# EAGLE design board (EAGLE 6.4)
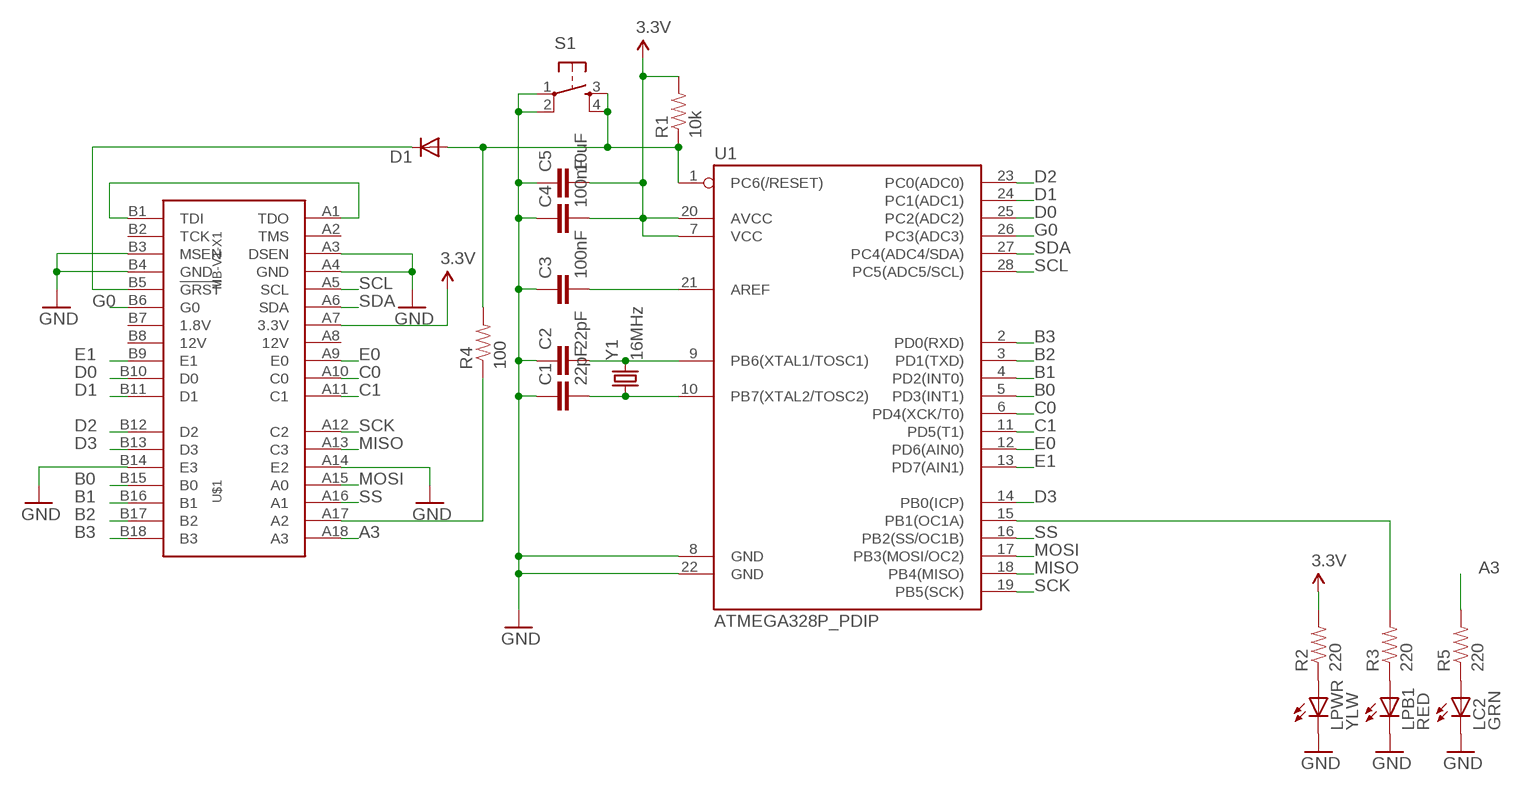
[diagram p0: schematic, sheet 1]

## Parts
C1  22pF  CAP0402-CAP  [0402-CAP]
C2  22pF  CAP0402-CAP  [0402-CAP]
C3  100nF  CAP0402-CAP  [0402-CAP]
C4  100nF  CAP0402-CAP  [0402-CAP]
C5  10uF  CAP0805  [0805]
D1  DIODE1N4148  [DIODE-1N4148]
LC2  GRN  LED-RED0603  [LED-0603]
LPB1  RED  LED-RED0603  [LED-0603]
LPWR  YLW  LED-RED0603  [LED-0603]
R1  10k  RESISTOR0603  [0603-RES]
R2  220  RESISTOR0603  [0603-RES]
R3  220  RESISTOR0603  [0603-RES]
R4  100  RESISTOR0603  [0603-RES]
R5  220  RESISTOR0603  [0603-RES]
S1  TAC_SWITCHPTH  [TACTILE-PTH]
U1  ATMEGA328P_PDIP  [DIL28-3]
U$1  MB-V1-X1  [PCIE-X1-EDGE]
Y1  16MHz  CRYSTALHC49US  [HC49US]

## Nets
3.3V: C4.2 C5.2 R1.2 R2.2 U1.7(VCC) U1.20(AVCC) U$1.A7(3.3V)
A3: R5.2 U$1.A18(A3)
B0: U1.5(PD3(INT1)) U$1.B15(B0)
B1: U1.4(PD2(INT0)) U$1.B16(B1)
B2: U1.3(PD1(TXD)) U$1.B17(B2)
B3: U1.2(PD0(RXD)) U$1.B18(B3)
C0: U1.6(PD4(XCK/T0)) U$1.A10(C0)
C1: U1.11(PD5(T1)) U$1.A11(C1)
D0: U1.25(PC2(ADC2)) U$1.B10(D0)
D1: U1.24(PC1(ADC1)) U$1.B11(D1)
D2: U1.23(PC0(ADC0)) U$1.B12(D2)
D3: U1.14(PB0(ICP)) U$1.B13(D3)
E0: U1.12(PD6(AIN0)) U$1.A9(E0)
E1: U1.13(PD7(AIN1)) U$1.B9(E1)
G0: U1.26(PC3(ADC3)) U$1.B6(G0)
GND: C1.1 C2.1 C3.1 C4.1 C5.1 LC2.C LPB1.C LPWR.C S1.1 S1.2 U1.8(GND) U1.22(GND) U$1.A3(DSEN) U$1.A4(GND) U$1.A14(E2) U$1.B3(MSEN) U$1.B4(GND) U$1.B14(E3)
MISO: U1.18(PB4(MISO)) U$1.A13(C3)
MOSI: U1.17(PB3(MOSI/OC2)) U$1.A15(A0)
N$1: D1.C U$1.B5(!GRST)
N$2: LPB1.A R3.1
N$3: C2.2 U1.9(PB6(XTAL1/TOSC1)) Y1.2
N$4: C1.2 U1.10(PB7(XTAL2/TOSC2)) Y1.1
N$5: C3.2 U1.21(AREF)
N$6: U$1.A1(TDO) U$1.B1(TDI)
N$7: LC2.A R5.1
N$8: R3.2 U1.15(PB1(OC1A))
N$9: R4.1 U$1.A17(A2)
N$25: LPWR.A R2.1
RST: D1.A R1.1 R4.2 S1.3 S1.4 U1.1(PC6(/RESET))
SCK: U1.19(PB5(SCK)) U$1.A12(C2)
SCL: U1.28(PC5(ADC5/SCL)) U$1.A5(SCL)
SDA: U1.27(PC4(ADC4/SDA)) U$1.A6(SDA)
SS: U1.16(PB2(SS/OC1B)) U$1.A16(A1)
Unconnected: U$1.A2(TMS) U$1.A8(12V) U$1.B2(TCK) U$1.B7(1.8V) U$1.B8(12V)

## Library data of the parts
C1-C5 = kmod-passives:CAP: Capacitor Standard 0603 ceramic capacitor, and 0.1" leaded capacitor.
D1 = SparkFun-DiscreteSemi:DIODE: Diode These are standard reverse protection diodes and small signal diodes. SMA package can handle up to about 1A. SOD-323 can handle about 200mA. What the SOD-323 package when ordering, there are some mfgs out there that are 5-pin packages.
LC2 LPWR = SparkFun-LED:LED-RED: Assorted Red LEDs LilyPad 1206- DIO-09912 1206- DIO-00809 0603- DIO-00819; PROD_ID: DIO-00819; VALUE: RED
LPB1 = SparkFun-LED:LED-RED: Assorted Red LEDs LilyPad 1206- DIO-09912 1206- DIO-00809 0603- DIO-00819; PROD_ID: DIO-00819
R1 R4 = kmod-passives:RESISTOR: Resistor Basic schematic elements and footprints for 0603, 1206, and PTH resistors.
R2 R3 R5 = SparkFun-Resistors:RESISTOR: Resistor Basic schematic elements and footprints for 0603, 1206, and PTH resistors.
S1 = kmod-mechanical:TAC_SWITCH: Momentary Switch Button commonly used for reset or general input. Spark Fun Electronics SKU : COM-00097 SMT- SWCH-08247
U1 = SparkFun-DigitalIC:ATMEGA328P_PDIP: uC used in the Arduino 32kb flash, 1k EEPROM, 2k SRAM This is the through-hole version of this chip.
U$1 = kmod-connectors:MB-V1-X1
Y1 = SparkFun-FreqCtrl:CRYSTAL: Various standard crystals. Proven footprints. Spark Fun Electronics SKU : COM-00534

## Board
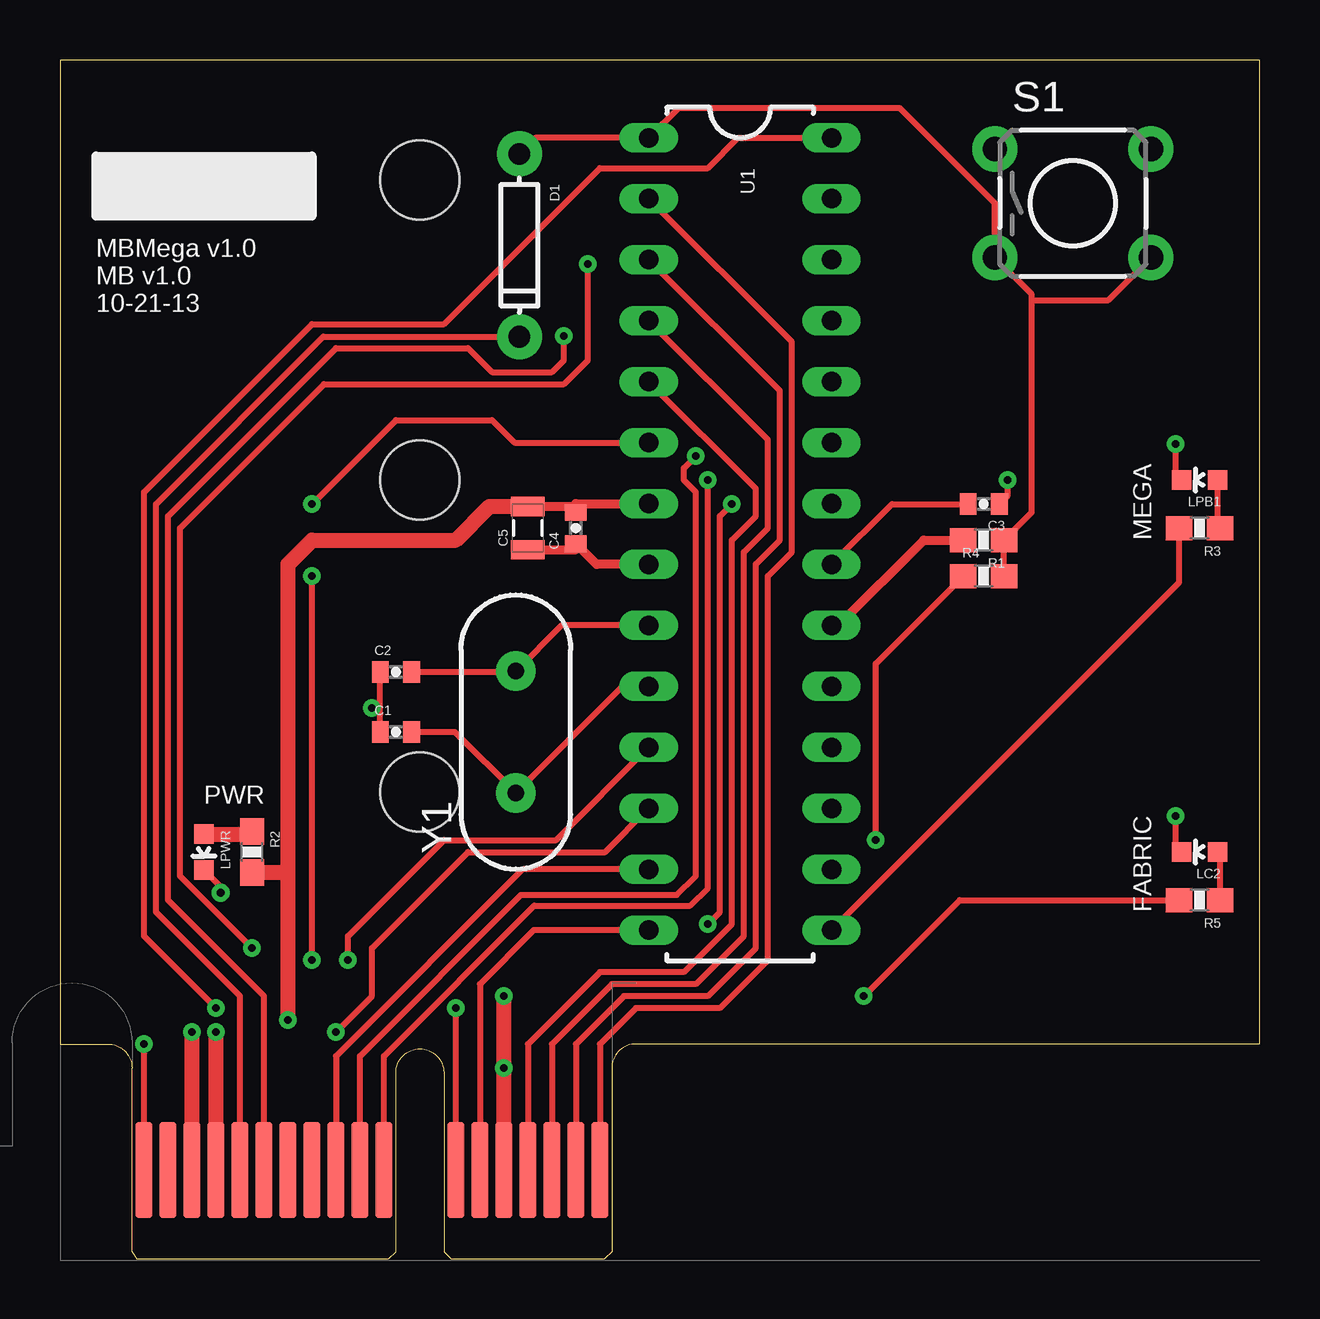
[diagram p1: board, top side]
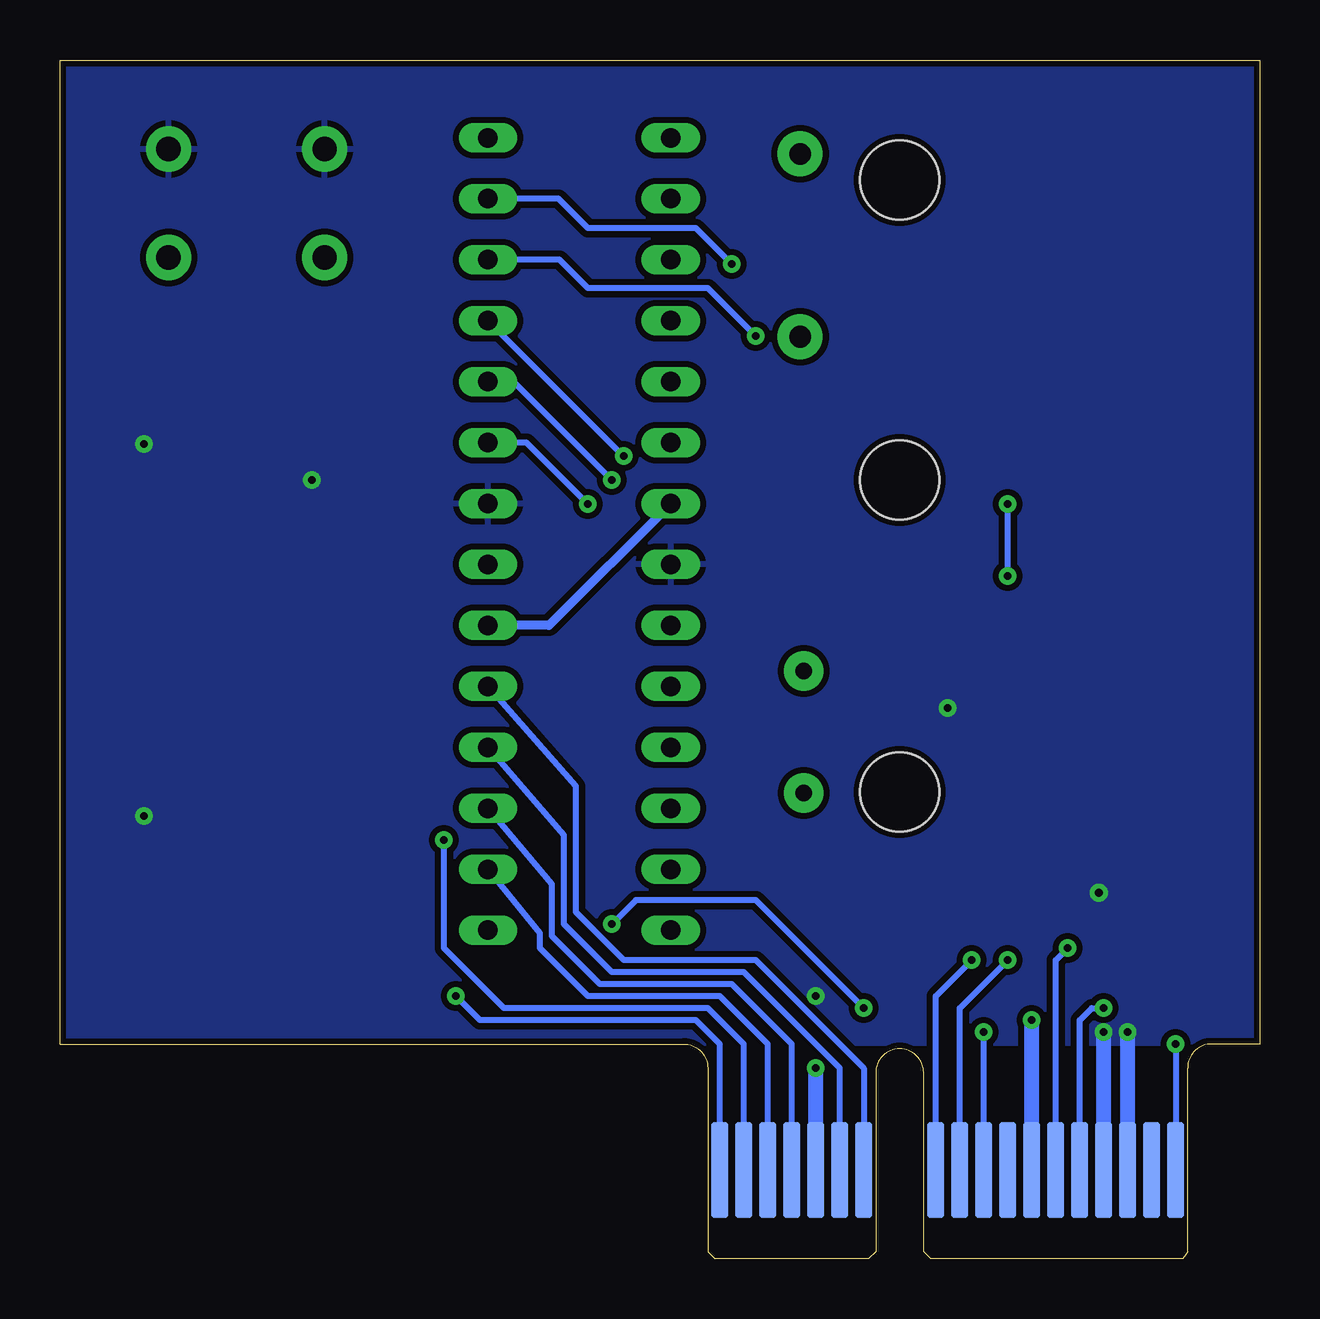
[diagram p2: board, bottom side, seen from below]

Size 50 x 49.95 mm. Coordinates in mm from the lower left corner, seen from the top.
Outline: 3,7.95 arc90 2,8.95 0,8.95 0,49.95 50,49.95 50,8.95 24,8.95 arc90 23,7.95
Copper layers (1*16): Top 0.035mm / dielectric 1.5mm / Bottom 0.035mm
Design rules "SeeedStudio_mine": minimum track width 6mil, minimum drill 12mil, track to track 6mil, track to pad 6mil, pad to pad 6mil, via to via 6mil, smd to smd 6mil, copper to edge 10mil, drill to drill 10mil, minimum pad ring 6mil, minimum via ring 8mil, stop-mask expansion 2mil, vias tented up to drill 25mil, thermal gap 10mil
Holes 3.3 mm at 15,19.45 15,44.95 15,32.45

### Footprints (pad centres in the part's own frame; a part is rotated, then mirrored left to right if it is on the bottom)
0402-CAP = smd 0.7 x 0.9: 1 -0.65,0; 2 0.65,0
0805 = smd 0.8 x 1.4: 1 -0.9,0; 2 0.9,0
DIODE-1N4148 = drill 0.9 pad 1.88: A -3.81,0; C 3.81,0
LED-0603 = smd 0.8 x 0.8: A 0,-0.75; C 0,0.75
0603-RES = smd 1.1 x 1: 1 -0.85,0; 2 0.85,0
TACTILE-PTH = drill 1.016 pad 1.88: 1 -3.251,2.261; 2 3.251,2.261; 3 -3.251,-2.261; 4 3.251,-2.261
DIL28-3 = drill 0.813 long: 1 -16.51,-3.81; 2 -13.97,-3.81; 3 -11.43,-3.81; 4 -8.89,-3.81; 5 -6.35,-3.81; 6 -3.81,-3.81; 7 -1.27,-3.81; 8 1.27,-3.81; 9 3.81,-3.81; 10 6.35,-3.81; 11 8.89,-3.81; 12 11.43,-3.81; 13 13.97,-3.81; 14 16.51,-3.81; 15 16.51,3.81; 16 13.97,3.81; 17 11.43,3.81; 18 8.89,3.81; 19 6.35,3.81; 20 3.81,3.81; 21 1.27,3.81; 22 -1.27,3.81; 23 -3.81,3.81; 24 -6.35,3.81; 25 -8.89,3.81; 26 -11.43,3.81; 27 -13.97,3.81; 28 -16.51,3.81
PCIE-X1-EDGE = smd 0.7 x 4 bottom: A1 -11.5,-0.75; A2 -10.5,-0.75; A3 -9.5,-0.75; A4 -8.5,-0.75; A5 -7.5,-0.75; A6 -6.5,-0.75; A7 -5.5,-0.75; A8 -4.5,-0.75; A9 -3.5,-0.75; A10 -2.5,-0.75; A11 -1.5,-0.75; A12 1.5,-0.75; A13 2.5,-0.75; A14 3.5,-0.75; A15 4.5,-0.75; A16 5.5,-0.75; A17 6.5,-0.75; A18 7.5,-0.75 | smd 0.7 x 4: B1 -11.5,-0.75; B2 -10.5,-0.75; B3 -9.5,-0.75; B4 -8.5,-0.75; B5 -7.5,-0.75; B6 -6.5,-0.75; B7 -5.5,-0.75; B8 -4.5,-0.75; B9 -3.5,-0.75; B10 -2.5,-0.75; B11 -1.5,-0.75; B12 1.5,-0.75; B13 2.5,-0.75; B14 3.5,-0.75; B15 4.5,-0.75; B16 5.5,-0.75; B17 6.5,-0.75; B18 7.5,-0.75
HC49US = drill 0.7 pad 1.651: 1 -2.54,0; 2 2.54,0

### Placement (x,y rotation side)
C1  14,21.95 0 top
C2  14,24.45 0 top
C3  38.5,31.45 180 top
C4  21.5,30.45 90 top
C5  19.5,30.45 90 top
D1  19.15,42.23 270 top
LC2  47.5,16.95 90 top
LPB1  47.5,32.45 90 top
LPWR  6,16.95 180 top
R1  38.5,29.95 180 top
R2  8,16.95 270 top
R3  47.5,30.45 180 top
R4  38.5,28.45 0 top
R5  47.5,14.95 180 top
S1  42.22,43.98 0 top
U1  28.35,30.2 270 top
U$1  15,4.45 0 top
Y1  19,21.95 90 top

### Tracks (layer width: path | path; a pad name or v marks a point on that pad's centre or on a via)
3.3V  (via drill 0.33)
  Top 0.254: 21.5,31.35 C4.2 21.5,31.47
  Top 0.381: C5.2 21.5,31.35 | 21.5,31.47 U1.7 | U1.20 32.44,26.39 36,29.95 R1.2
  Top 0.635: v9.5,9.95 9.5,15.95 | 9.5,15.95 9.5,28.95 10.5,29.95 16.5,29.95 17.9,31.35 C5.2 | R2.2 9.35,16.1 9.5,15.95
  Bottom 0.381: U1.7 29.62,26.39 U1.20
  Bottom 0.635: U$1.A7 v9.5,9.95
A3  (via drill 0.33)
  Top 0.254: v33.5,10.95 37.5,14.95 R5.2
  Bottom 0.254: U$1.A18 22.5,8.95 23.5,9.95 32.5,9.95 v33.5,10.95
B0
  Top 0.254: U1.5 29,32.09 29,30.95 28,29.95 28,13.95 26,11.95 22.5,11.95 19.5,8.95 U$1.B15
B1
  Top 0.254: U1.4 29.5,34.13 29.5,30.45 28.5,29.45 28.5,13.45 26.5,11.45 23,11.45 20.5,8.95 U$1.B16
B2
  Top 0.254: U1.3 30,36.17 30,29.95 29,28.95 29,12.95 27,10.95 23.5,10.95 21.5,8.95 U$1.B17
B3
  Top 0.254: 22.5,4.45 U$1.B18 22.5,8.95 24,10.45 27.5,10.45 29.5,12.45 29.5,28.45 30.5,29.45 30.5,38.21 U1.2
C0  (via drill 0.33)
  Top 0.254: v10.5,12.45 v10.5,28.45 | v10.5,31.45 14,34.95 18,34.95 18.94,34.01 U1.6
  Bottom 0.254: U$1.A10 12.5,10.45 v10.5,12.45 | v10.5,28.45 v10.5,31.45
C1  (via drill 0.33)
  Top 0.254: U1.11 20.68,17.45 16,17.45 12,13.45 v12,12.45
  Bottom 0.254: U$1.A11 13.5,10.95 v12,12.45
D0  (via drill 0.33)
  Top 0.254: U$1.B10 12.5,8.45 19.2,15.15 25.7,15.15 26.5,15.95 26.5,31.95 26,32.45 26,32.95 v26.5,33.45
  Bottom 0.254: v26.5,33.45 26.52,33.45 U1.25
D1  (via drill 0.33)
  Top 0.254: U$1.B11 13.5,8.45 19.77,14.72 26.27,14.72 27,15.45 v27,32.45
  Bottom 0.254: v27,32.45 31.1,36.55 U1.24
D2  (via drill 0.33)
  Top 0.254: U$1.B12 v16.5,10.45 | v28,31.45 27.5,30.95 27.5,14.45 v27,13.95
  Bottom 0.254: v28,31.45 30.56,34.01 U1.23 | v16.5,10.45 21,14.95 26,14.95 v27,13.95
D3
  Top 0.254: U1.14 19.74,13.69 17.5,11.45 U$1.B13
E0  (via drill 0.33)
  Top 0.254: U1.12 22.72,16.95 17,16.95 13,12.95 13,10.95 v11.5,9.45
  Bottom 0.254: U$1.A9 v11.5,9.45
E1
  Top 0.254: U1.13 19.28,16.23 11.5,8.45 U$1.B9
G0  (via drill 0.33)
  Top 0.254: U$1.B6 8.5,10.95 4.5,14.95 4.5,30.95 11.5,37.95 17,37.95 18,36.95 20.5,36.95 21,37.45 v21,38.45
  Bottom 0.254: v21,38.45 23,40.45 28,40.45 29.18,41.63 U1.26
GND  (via drill 0.33)
  Top 0.254: LC2.C 46.5,16.95 v46.5,18.45 | LPB1.C 46.5,32.45 v46.5,33.95 | 32.16,31.45 U1.22 | 21.5,29.55 C4.1 | C1.1 13.35,22.7 | 13.35,22.7 C2.1 | 13.35,22.7 13.1,22.95 v13,22.95 | C3.1 39.5,31.8 v39.5,32.45 | LPWR.C 6.7,15.5 v6.7,15.25
  Top 0.381: C5.1 21.5,29.55 | U1.8 22.37,28.93 C4.1
  Top 0.635: U$1.B3 v5.5,9.45 | U$1.B4 v6.5,9.45 | U$1.A14 v18.5,7.95 v18.5,10.95
  Bottom 0.635: U$1.B4 v6.5,9.45 | U$1.B3 v5.5,9.45 | U$1.A14 v18.5,7.95
  pour Bottom (isolate 0.254): 0,49.95 50,49.95 50,8.95 0,8.95
MISO
  Bottom 0.254: U1.18 29,17.65 29,13.95 27,11.95 21.5,11.95 17.5,7.95 U$1.A13
MOSI
  Bottom 0.254: U1.17 29.5,15.61 29.5,13.45 27.5,11.45 22,11.45 19.5,8.95 U$1.A15
N$1
  Top 0.254: U$1.B5 7.5,10.95 4,14.45 4,31.45 10.97,38.42 D1.C
N$2
  Top 0.254: R3.1 48.25,30.55 LPB1.A
N$3
  Top 0.254: U1.9 20.9,26.39 Y1.2 18.96,24.45 C2.2
N$4
  Top 0.254: U1.10 23.44,23.85 Y1.1 16.46,21.95 C1.2
N$5
  Top 0.254: U1.21 34.68,31.45 C3.2
N$6  (via drill 0.33)
  Top 0.254: U$1.A1 v3.5,8.95
  Bottom 0.254: v3.5,8.95 U$1.A1
N$7
  Top 0.254: LC2.A 48.35,16.85 R5.1
N$8
  Top 0.254: U1.15 46.65,28.18 R3.2
N$9  (via drill 0.33)
  Top 0.254: v34,17.45 34,24.8 R4.1
  Bottom 0.254: U$1.A17 21.5,8.95 23,10.45 31.5,10.45 34,12.95 v34,17.45
N$25
  Top 0.635: LPWR.A 7.9,17.7 R2.1
RST
  Top 0.254: R4.2 R1.1 40.5,31.1 40.5,39.95 | 40.5,39.95 40.5,40.19 S1.3 38.97,43.98 35,47.95 25.78,47.95 U1.1 19.82,46.71 D1.A | 40.5,39.95 43.7,39.95 S1.4
SCK
  Bottom 0.254: U1.19 28.5,19.69 28.5,14.45 26.5,12.45 21,12.45 16.5,7.95 U$1.A12
SCL  (via drill 0.33)
  Top 0.254: v6.5,10.45 3.5,13.45 3.5,31.95 10.5,38.95 16,38.95 22.5,45.45 27,45.45 28.26,46.71 U1.28
  Bottom 0.254: U$1.A5 7.5,9.95 7,10.45 v6.5,10.45
SDA  (via drill 0.33)
  Top 0.254: v8,12.95 5,15.95 5,30.45 11,36.45 21,36.45 22,37.45 v22,41.45
  Bottom 0.254: U$1.A6 8.5,12.45 v8,12.95 | v22,41.45 23.5,42.95 28,42.95 29.22,44.17 U1.27
SS
  Bottom 0.254: U1.16 30,13.57 30,12.95 28,10.95 22.5,10.95 20.5,8.95 U$1.A16

### Text on the board
tPlace: MBMega v1.0 / MB v1.0 / 10-21-13 | MEGA | PWR | FABRIC